# Altium schematic sheet Block_Diagram.SchDoc
size A4; SheetNumber: 1; SheetTotal: 6; Authot_Mail: iekarsavuran@gmail.com; Project_Name: Burglar Alarm System; Size: A3
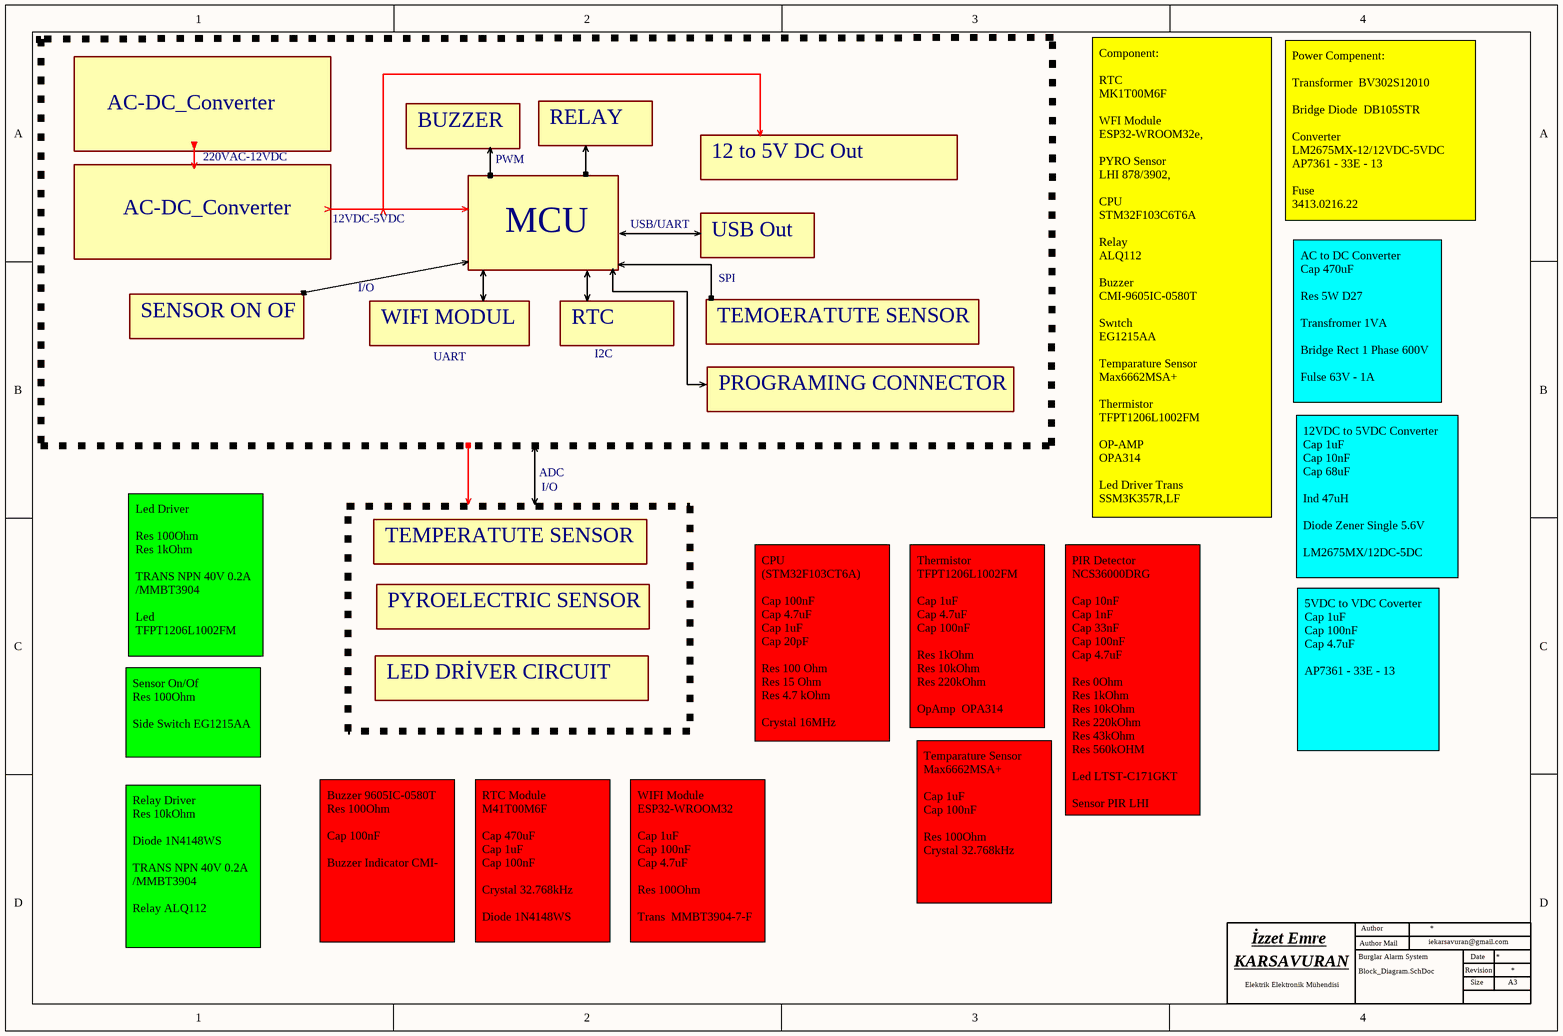
[diagram p0: Block_Diagram.SchDoc]

## Notes on the sheet
- AC-DC_Converter
- 220VAC-12VDC
- BUZZER
- PWM
- RELAY
- 12 to 5V DC Out
- 12VDC-5VDC
- MCU
- USB/UART
- USB Out
- Power Compenent:
  Transformer  BV302S12010
  Bridge Diode  DB105STR
  Converter
  LM2675MX-12/12VDC-5VDC
  AP7361 - 33E - 13
  Fuse
  3413.0216.22
- I/O
- SPI
- SENSOR ON OF
- WIFI MODUL
- UART
- RTC
- I2C
- TEMOERATUTE SENSOR
- PROGRAMING CONNECTOR
- AC to DC Converter
  Cap 470uF
  Res 5W D27
  Transfromer 1VA
  Bridge Rect 1 Phase 600V
  Fulse 63V - 1A
- ADC
- Component:
  RTC
  MK1T00M6F
  WFI Module
  ESP32-WROOM32e,
  PYRO Sensor
  LHI 878/3902,
  CPU
  STM32F103C6T6A
  Relay
  ALQ112
  Buzzer
  CMI-9605IC-0580T
  Swıtch
  EG1215AA
  Temparature Sensor
  Max6662MSA+
  Thermistor
  TFPT1206L1002FM
  OP-AMP
  OPA314
  Led Driver Trans
  SSM3K357R,LF
- TEMPERATUTE SENSOR
- 12VDC to 5VDC Converter
  Cap 1uF
  Cap 10nF
  Cap 68uF
  Ind 47uH
  Diode Zener Single 5.6V
  LM2675MX/12DC-5DC
- Led Driver
  Res 100Ohm
  Res 1kOhm
  TRANS NPN 40V 0.2A /MMBT3904
  Led TFPT1206L1002FM
- PYROELECTRIC SENSOR
- LED DRİVER CIRCUIT
- Sensor On/Of
  Res 100Ohm
  Side Switch EG1215AA
- CPU
  (STM32F103CT6A)
  Cap 100nF
  Cap 4.7uF
  Cap 1uF
  Cap 20pF
  Res 100 Ohm
  Res 15 Ohm
  Res 4.7 kOhm
  Crystal 16MHz
- Thermistor
  TFPT1206L1002FM
  Cap 1uF
  Cap 4.7uF
  Cap 100nF
  Res 1kOhm
  Res 10kOhm
  Res 220kOhm
  OpAmp  OPA314
- 5VDC to VDC Coverter
  Cap 1uF
  Cap 100nF
  Cap 4.7uF
  AP7361 - 33E - 13
- PIR Detector
  NCS36000DRG
  Cap 10nF
  Cap 1nF
  Cap 33nF
  Cap 100nF
  Cap 4.7uF
  Res 0Ohm
  Res 1kOhm
  Res 10kOhm
  Res 220kOhm
  Res 43kOhm
  Res 560kOHM
  Led LTST-C171GKT
  Sensor PIR LHI 878/3902
- Temparature Sensor
  Max6662MSA+
  Cap 1uF
  Cap 100nF
  Res 100Ohm
  Crystal 32.768kHz
- Relay Driver
  Res 10kOhm
  Diode 1N4148WS
  TRANS NPN 40V 0.2A /MMBT3904
  Relay ALQ112
- Buzzer 9605IC-0580T
  Res 100Ohm
  Cap 100nF
  Buzzer Indicator CMI-
- RTC Module
  M41T00M6F
  Cap 470uF
  Cap 1uF
  Cap 100nF
  Crystal 32.768kHz
  Diode 1N4148WS
- WIFI Module           ESP32-WROOM32
  Cap 1uF
  Cap 100nF
  Cap 4.7uF
  Res 100Ohm
  Trans  MMBT3904-7-F
- KARSAVURAN <https://github.com/iek21?>
- Elektrik Elektronik Mühendisi
- İzzet Emre <https://www.linkedin.com/in/izzet-emre-karsavuran-24704417b>
- Author Mail
- Author
- Revision
- Date
- Size